# Altium schematic sheet Main.SchDoc
size A4
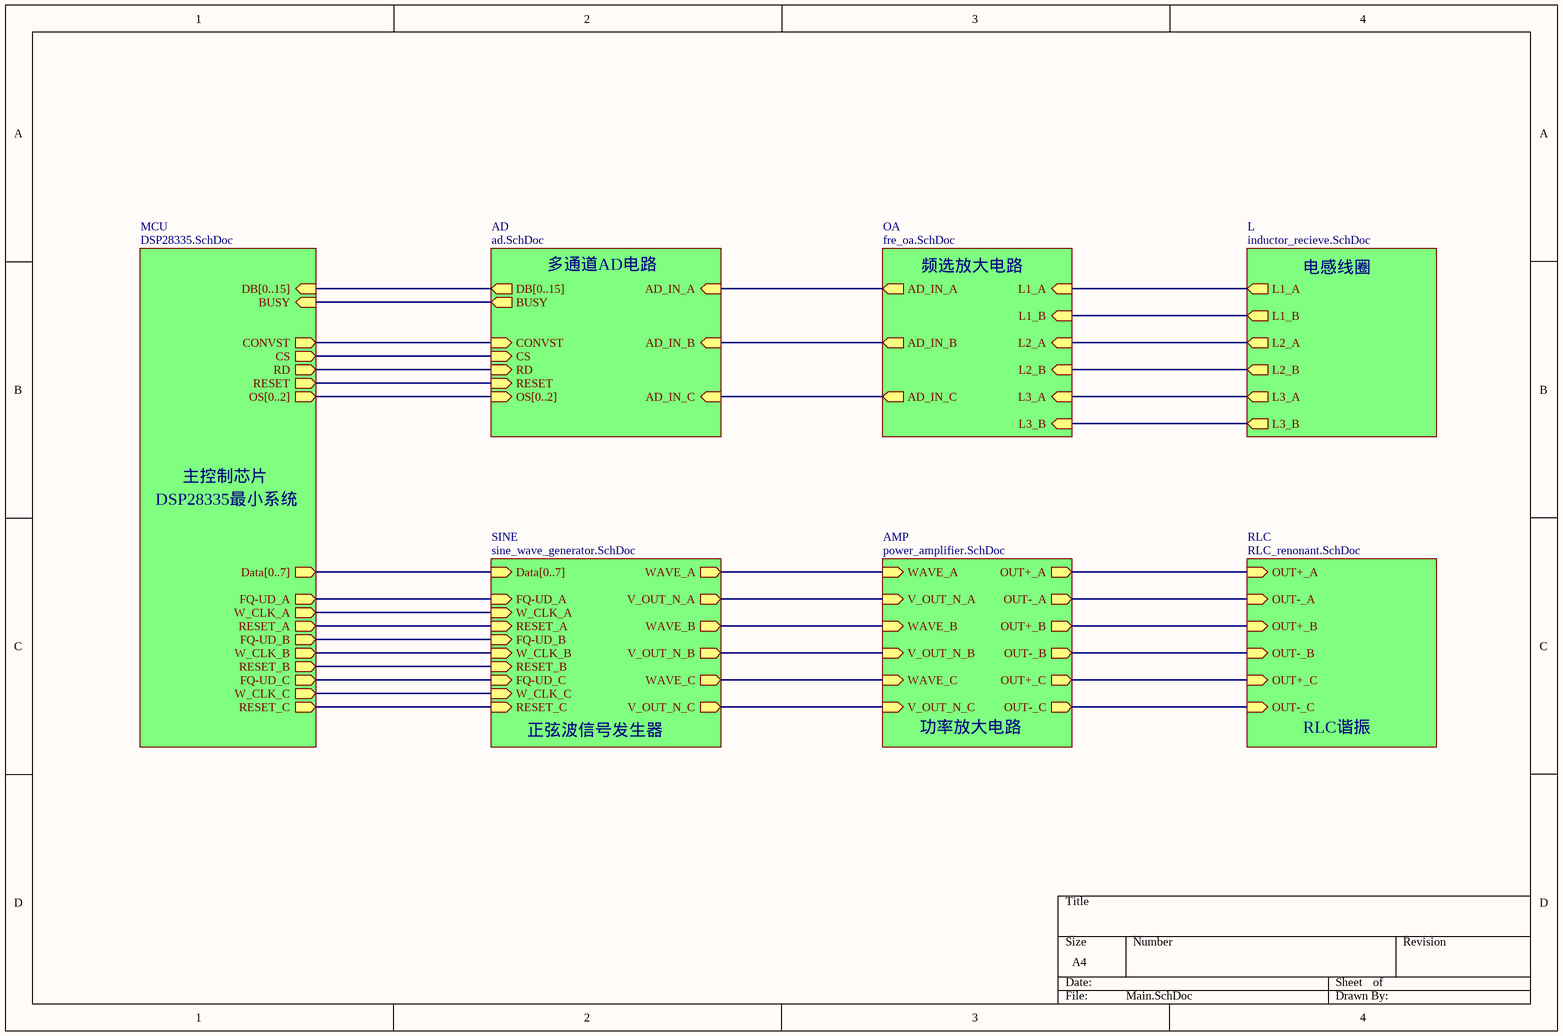
[diagram p0: Main.SchDoc]

## Sub-sheets
AD = ad.SchDoc: AD_IN_A (in), AD_IN_B (in), AD_IN_C (in), DB[0..15] (out), BUSY (out), CONVST (in), CS (in), RD (in), RESET (in), OS[0..2] (in)
AMP = power_amplifier.SchDoc: WAVE_A (in), V_OUT_N_A (in), WAVE_B (in), V_OUT_N_B (in), WAVE_C (in), V_OUT_N_C (in), OUT+_A (out), OUT-_A (out), OUT+_B (out), OUT-_B (out), OUT-_C (out), OUT+_C (out)
L = inductor_recieve.SchDoc: L3_B (out), L3_A (out), L2_B (out), L2_A (out), L1_A (out), L1_B (out)
MCU = DSP28335.SchDoc: Data[0..7] (out), FQ-UD_A (out), W_CLK_A (out), RESET_A (out), FQ-UD_B (out), W_CLK_B (out), RESET_B (out), FQ-UD_C (out), W_CLK_C (out), RESET_C (out), DB[0..15] (in), BUSY (in), CONVST (out), CS (out), RD (out), RESET (out), OS[0..2] (out)
OA = fre_oa.SchDoc: L1_A (in), L1_B (in), L2_A (in), L2_B (in), L3_A (in), L3_B (in), AD_IN_A (out), AD_IN_B (out), AD_IN_C (out)
RLC = RLC_renonant.SchDoc: OUT+_A (in), OUT-_A (in), OUT-_B (in), OUT+_B (in), OUT+_C (in), OUT-_C (in)
SINE = sine_wave_generator.SchDoc: RESET_C (in), W_CLK_C (in), FQ-UD_C (in), RESET_B (in), W_CLK_B (in), FQ-UD_B (in), W_CLK_A (in), RESET_A (in), FQ-UD_A (in), Data[0..7] (in), WAVE_A (out), V_OUT_N_A (out), WAVE_B (out), V_OUT_N_B (out), WAVE_C (out), V_OUT_N_C (out)

## Nets
(unnamed): sheet MCU/FQ-UD_A, sheet SINE/FQ-UD_A
(unnamed): sheet MCU/W_CLK_A, sheet SINE/W_CLK_A
(unnamed): sheet MCU/RESET_A, sheet SINE/RESET_A
(unnamed): sheet MCU/FQ-UD_B, sheet SINE/FQ-UD_B
(unnamed): sheet MCU/W_CLK_B, sheet SINE/W_CLK_B
(unnamed): sheet MCU/RESET_B, sheet SINE/RESET_B
(unnamed): sheet MCU/FQ-UD_C, sheet SINE/FQ-UD_C
(unnamed): sheet MCU/W_CLK_C, sheet SINE/W_CLK_C
(unnamed): sheet MCU/RESET_C, sheet SINE/RESET_C
(unnamed): sheet MCU/BUSY, sheet AD/BUSY
(unnamed): sheet MCU/CONVST, sheet AD/CONVST
(unnamed): sheet MCU/CS, sheet AD/CS
(unnamed): sheet MCU/RD, sheet AD/RD
(unnamed): sheet MCU/RESET, sheet AD/RESET
(unnamed): sheet SINE/WAVE_A, sheet AMP/WAVE_A
(unnamed): sheet SINE/V_OUT_N_A, sheet AMP/V_OUT_N_A
(unnamed): sheet SINE/WAVE_B, sheet AMP/WAVE_B
(unnamed): sheet SINE/V_OUT_N_B, sheet AMP/V_OUT_N_B
(unnamed): sheet SINE/WAVE_C, sheet AMP/WAVE_C
(unnamed): sheet SINE/V_OUT_N_C, sheet AMP/V_OUT_N_C
(unnamed): sheet AMP/OUT+_A, sheet RLC/OUT+_A
(unnamed): sheet AMP/OUT-_A, sheet RLC/OUT-_A
(unnamed): sheet AMP/OUT+_B, sheet RLC/OUT+_B
(unnamed): sheet AMP/OUT-_B, sheet RLC/OUT-_B
(unnamed): sheet AMP/OUT-_C, sheet RLC/OUT-_C
(unnamed): sheet AMP/OUT+_C, sheet RLC/OUT+_C
(unnamed): sheet L/L3_B, sheet OA/L3_B
(unnamed): sheet L/L3_A, sheet OA/L3_A
(unnamed): sheet L/L2_B, sheet OA/L2_B
(unnamed): sheet L/L2_A, sheet OA/L2_A
(unnamed): sheet L/L1_A, sheet OA/L1_A
(unnamed): sheet L/L1_B, sheet OA/L1_B
(unnamed): sheet OA/AD_IN_A, sheet AD/AD_IN_A
(unnamed): sheet OA/AD_IN_B, sheet AD/AD_IN_B
(unnamed): sheet OA/AD_IN_C, sheet AD/AD_IN_C

## Buses and harness runs
bus sheet AD/DB[0..15] = sheet MCU/DB[0..15]
bus sheet AD/OS[0..2] = sheet MCU/OS[0..2]
bus sheet MCU/Data[0..7] = sheet SINE/Data[0..7]

## Notes on the sheet
- 多通道AD电路
- 频选放大电路
- 电感线圈
- DSP28335最小系统
- 主控制芯片
- 正弦波信号发生器
- 功率放大电路
- RLC谐振